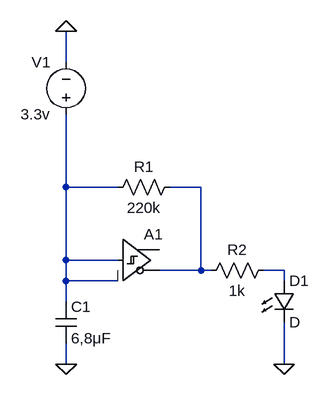
[diagram p0: schematic Led-flasher.asc]
Led-flasher.asc, the LTspice schematic file:
Version 4.1
SHEET 1 880 680
WIRE 96 -192 96 -240
WIRE 96 0 96 -112
WIRE 176 0 96 0
WIRE 304 0 256 0
WIRE 96 112 96 0
WIRE 176 112 96 112
WIRE 304 128 304 0
WIRE 304 128 240 128
WIRE 320 128 304 128
WIRE 432 128 400 128
WIRE 96 144 96 112
WIRE 176 144 96 144
WIRE 432 144 432 128
WIRE 96 176 96 144
WIRE 96 272 96 240
WIRE 432 272 432 208
FLAG 432 272 0
FLAG 96 -240 0
FLAG 96 272 0
SYMBOL Digital\\schmitt 176 48 R0
SYMATTR InstName A1
SYMBOL res 272 -16 R90
WINDOW 0 0 56 VBottom 2
WINDOW 3 32 56 VTop 2
SYMATTR InstName R1
SYMATTR Value 220k
SYMBOL res 416 112 R90
WINDOW 0 0 56 VBottom 2
WINDOW 3 32 56 VTop 2
SYMATTR InstName R2
SYMATTR Value 1k
SYMBOL LED 416 144 R0
SYMATTR InstName D1
SYMBOL voltage 96 -96 R180
WINDOW 0 24 96 Left 2
WINDOW 3 24 16 Left 2
SYMATTR InstName V1
SYMATTR Value 3.3v
SYMBOL cap 80 176 R0
SYMATTR InstName C1
SYMATTR Value 6,8μF

The netlist it stands for:
* Led-flasher.asc
A1 N001 N001 N001 N001 N001 N002 N001 N001 SCHMITT
R1 N002 N001 220k
R2 N003 N002 1k
D1 N003 0 D
V1 N001 0 3.3v
C1 N001 0 6,8μF
.model D D
.lib standard.dio
.backanno
.end